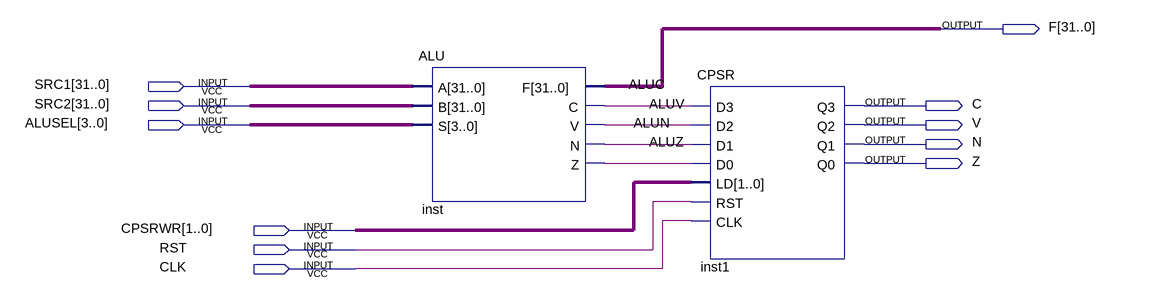
[diagram p0: schematic sheet]
// Quartus schematic EXECUTE.bdf as structural Verilog: 2 symbols, 11 pins
module EXECUTE (
  input  [31:0] SRC1,
  input  [31:0] SRC2,
  input  [3:0] ALUSEL,
  input  [1:0] CPSRWR,
  input  RST,
  input  CLK,
  output [31:0] F,
  output C,
  output V,
  output N,
  output Z
);

  wire ALUC, ALUN, ALUV, ALUZ;

  ALU inst (.A(SRC1), .B(SRC2), .S(ALUSEL), .F(F), .C(ALUC), .V(ALUV), .N(ALUN), .Z(ALUZ));
  CPSR inst1 (
    .D3(ALUC), .D2(ALUV), .D1(ALUN), .D0(ALUZ), .LD(CPSRWR), .RST(RST), .CLK(CLK), .Q3(C), .Q2(V), .Q1(N),
    .Q0(Z));
endmodule
